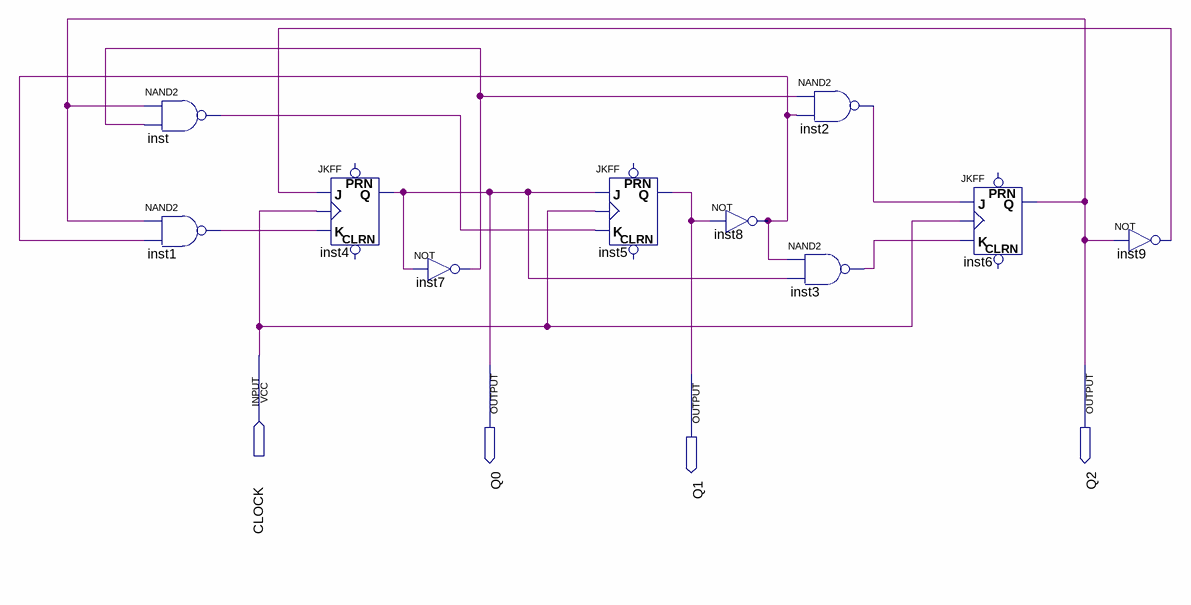
[diagram p0: schematic sheet]
// Quartus schematic ffjknand.bdf as structural Verilog: 10 symbols, 4 pins
module ffjknand (
  input  CLOCK,
  output Q0,
  output Q2,
  output Q1
);

  wire inst1_out, inst2_out, inst3_out, inst7_out, inst8_out, inst9_out, inst_out;

  nand inst (inst_out, Q2, inst7_out);
  nand inst1 (inst1_out, Q2, inst8_out);
  JKFF inst4 (.K(inst1_out), .J(inst9_out), .CLK(CLOCK), .Q(Q0));  // open: PRN, CLRN
  not inst7 (inst7_out, Q0);
  JKFF inst5 (.K(inst_out), .J(Q0), .CLK(CLOCK), .Q(Q1));  // open: PRN, CLRN
  not inst8 (inst8_out, Q1);
  nand inst2 (inst2_out, inst7_out, inst8_out);
  nand inst3 (inst3_out, inst8_out, Q0);
  JKFF inst6 (.K(inst3_out), .J(inst2_out), .CLK(CLOCK), .Q(Q2));  // open: PRN, CLRN
  not inst9 (inst9_out, Q2);
endmodule
